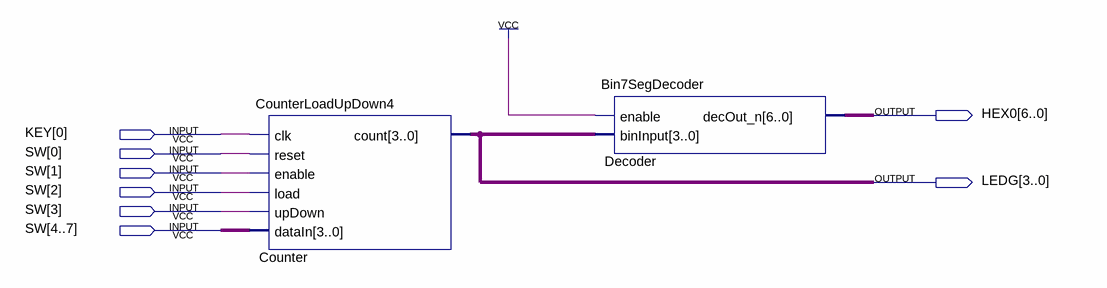
[diagram p0: schematic sheet]
// Quartus schematic CounterLoad_Demo.bdf as structural Verilog: 2 symbols, 8 pins
module CounterLoad_Demo (
  input  [0:0] KEY,
  input  [0:7] SW,
  output [6:0] HEX0,
  output [3:0] LEDG
);

  CounterLoadUpDown4 Counter (
    .clk(KEY[0]), .reset(SW[0]), .enable(SW[1]), .load(SW[2]), .upDown(SW[3]), .dataIn(SW[4:7]), .count(LEDG));
  Bin7SegDecoder Decoder (.enable(1'b1), .binInput(LEDG), .decOut_n(HEX0));
endmodule
